# EAGLE design beagleboard (EAGLE 8.1.1)
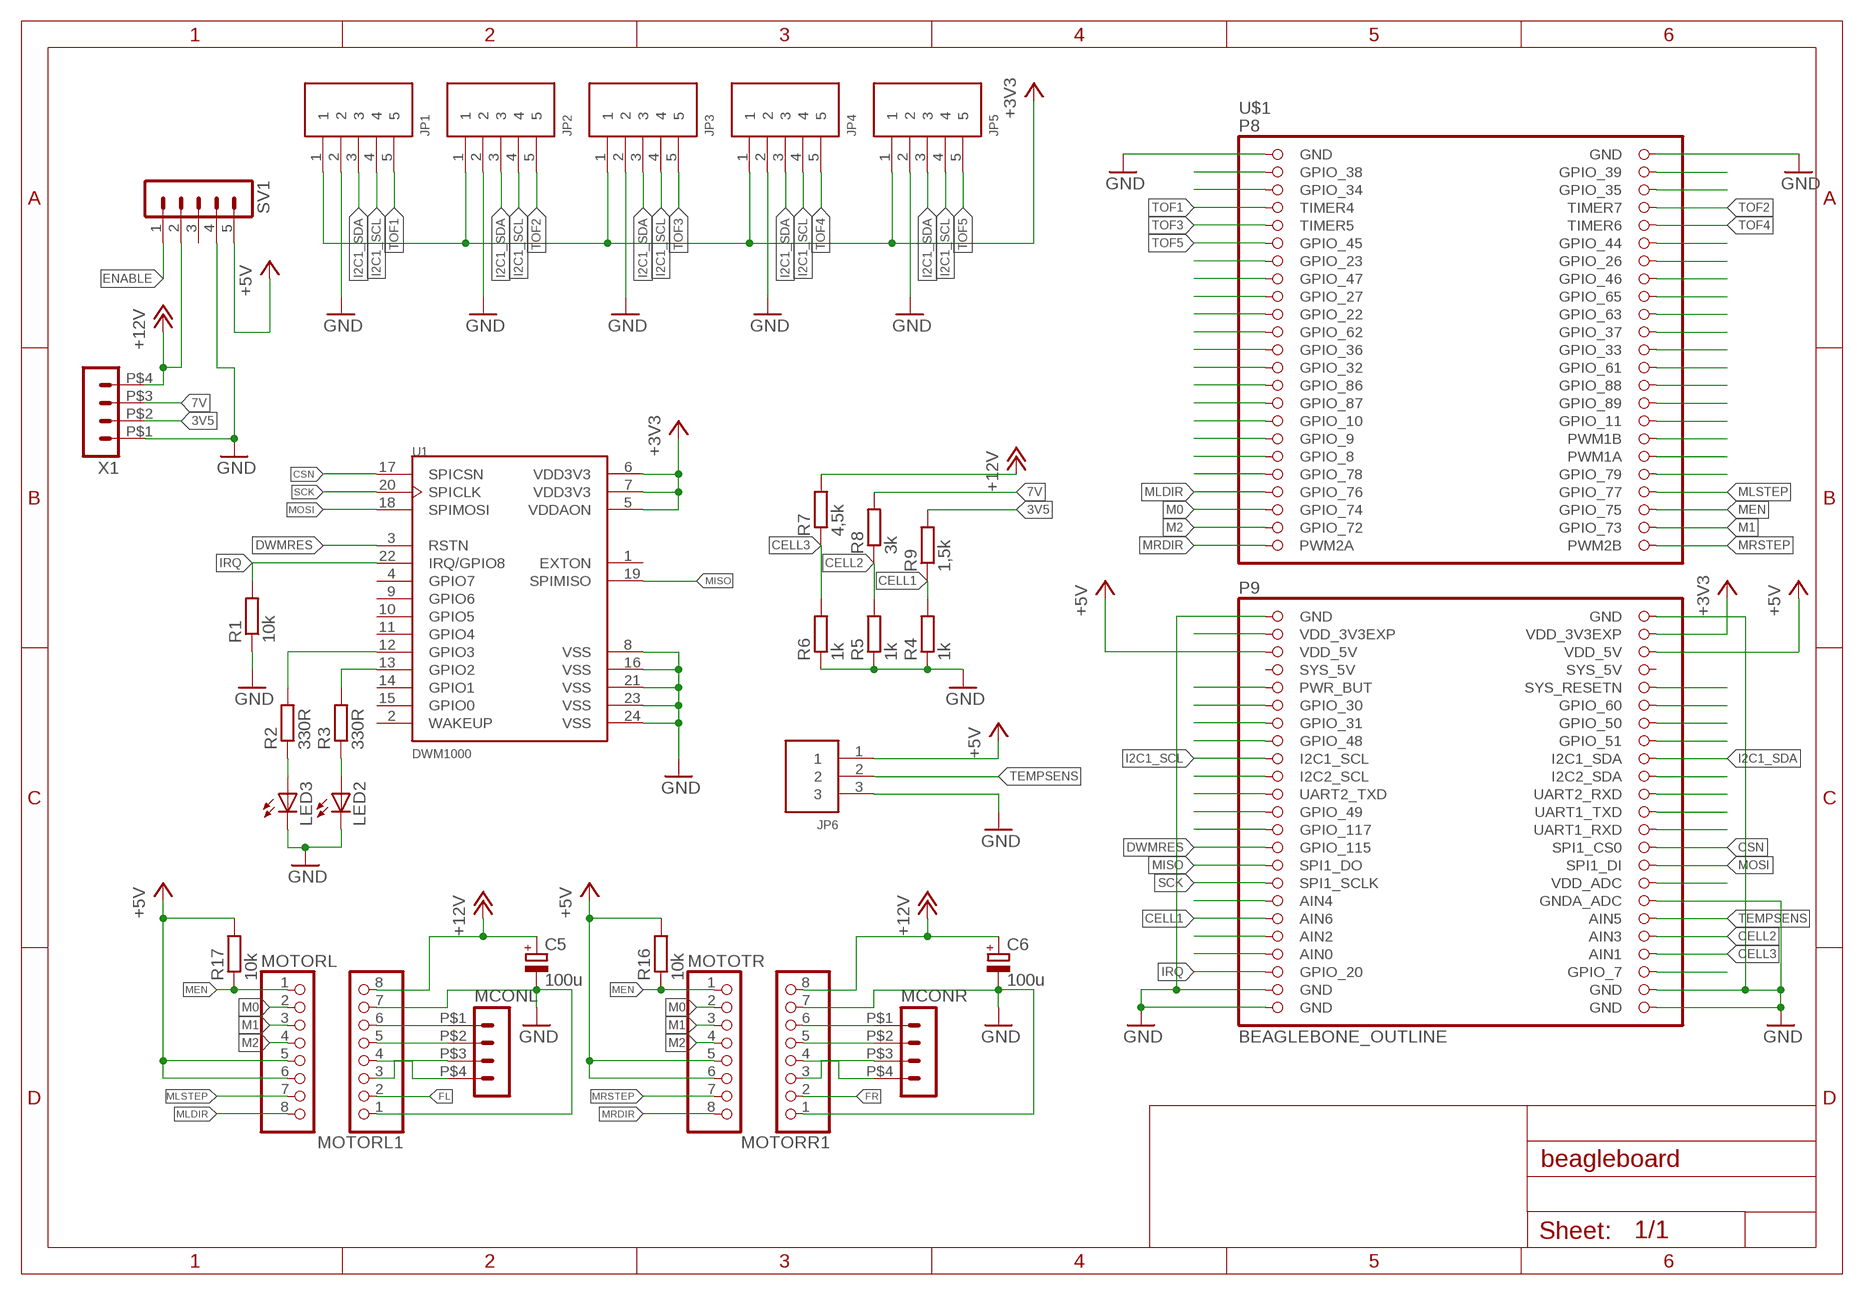
[diagram p0: schematic, sheet 1]

## Parts
C5  100u  CPOL-EU153CLV-0405  [153CLV-0405]
C6  100u  CPOL-EU153CLV-0405  [153CLV-0405]
JP1  5PIN  [B5B-PH-K-S]
JP2  5PIN  [B5B-PH-K-S]
JP3  5PIN  [B5B-PH-K-S]
JP4  5PIN  [B5B-PH-K-S]
JP5  5PIN  [B5B-PH-K-S]
JP6  3PIN  [B3B-PH-K-S]
LED2  LEDSML0603  [SML0603]
LED3  LEDSML0603  [SML0603]
MCONL  HEADER_POS4_43045-0412  [43045-0412]
MCONR  HEADER_POS4_43045-0412  [43045-0412]
MOTORL  PINHD-1X8  [1X08]
MOTORL1  PINHD-1X8  [1X08]
MOTORR1  PINHD-1X8  [1X08]
MOTOTR  PINHD-1X8  [1X08]
R1  10k  R-EU_R0603  [R0603]
R2  330R  R-EU_R0603  [R0603]
R3  330R  R-EU_R0603  [R0603]
R4  1k  R-EU_R0603  [R0603]
R5  1k  R-EU_R0603  [R0603]
R6  1k  R-EU_R0603  [R0603]
R7  4,5k  R-EU_R0603  [R0603]
R8  3k  R-EU_R0603  [R0603]
R9  1,5k  R-EU_R0603  [R0603]
R16  10k  R-EU_R0805  [R0805]
R17  10k  R-EU_R0805  [R0805]
SV1  MA05-1  [MA05-1]
U1  DWM1000  [XCVR_DWM1000]
U$1  BEAGLEBONE_OUTLINE  [BEAGLEBONE_SHIELD]
X1  HEADER_POS4_43045-0412  [43045-0412]

## Nets
3V5: R9.2 X1.P$2
7V: R8.2 X1.P$3
+3V3: JP1.1 JP2.1 JP3.1 JP4.1 JP5.1 U1.5(VDDAON) U1.6(VDD3V3) U1.7(VDD3V3) U$1.50(VDD_3V3EXP)
+5V: JP6.1 MOTORL.5 MOTORL.6 MOTOTR.5 MOTOTR.6 R16.2 R17.2 SV1.5 U$1.51(VDD_5V) U$1.52(VDD_5V)
+12V: C5.+ C6.+ MOTORL1.8 MOTORR1.8 R7.2 SV1.2 X1.P$4
CELL1: R4.2 R9.1 U$1.81(AIN6)
CELL2: R5.2 R8.1 U$1.84(AIN3)
CELL3: R6.2 R7.1 U$1.86(AIN1)
CSN: U1.17(SPICSN) U$1.74(SPI1_CS0)
D4ECHO: U$1.85(AIN0)
D4TRIG: U$1.83(AIN2)
DWMRES: U1.3(RSTN) U$1.73(GPIO_115)
ENABLE: SV1.1
FL: MOTORL1.2
FR: MOTORR1.2
GND: C5.- C6.- JP1.2 JP2.2 JP3.2 JP4.2 JP5.2 JP6.3 LED2.C LED3.C MOTORL1.1 MOTORL1.7 MOTORR1.1 MOTORR1.7 R1.1 R4.1 R5.1 R6.1 SV1.4 U1.8(VSS) U1.16(VSS) U1.21(VSS) U1.23(VSS) U1.24(VSS) U$1.1(GND) U$1.2(GND) U$1.47(GND) U$1.80(GNDA_ADC) U$1.89(GND) U$1.90(GND) U$1.91(GND) U$1.92(GND) X1.P$1
I2C1_SCL: JP1.4 JP2.4 JP3.4 JP4.4 JP5.4 U$1.63(I2C1_SCL)
I2C1_SDA: JP1.3 JP2.3 JP3.3 JP4.3 JP5.3 U$1.64(I2C1_SDA)
IRQ: R1.2 U1.22(IRQ/GPIO8) U$1.87(GPIO_20)
M0: MOTORL.2 MOTOTR.2 U$1.41(GPIO_74)
M1: MOTORL.3 MOTOTR.3 U$1.44(GPIO_73)
M2: MOTORL.4 MOTOTR.4 U$1.43(GPIO_72)
MEN: MOTORL.1 MOTOTR.1 R16.1 R17.1 U$1.42(GPIO_75)
MISO: U1.19(SPIMISO) U$1.75(SPI1_DO)
MLDIR: MOTORL.8 U$1.39(GPIO_76)
MLSTEP: MOTORL.7 U$1.40(GPIO_77)
MOSI: U1.18(SPIMOSI) U$1.76(SPI1_DI)
MRDIR: MOTOTR.8 U$1.45(PWM2A)
MRSTEP: MOTOTR.7 U$1.46(PWM2B)
N$1: MCONL.P$4 MOTORL1.4
N$2: R3.2 U1.13(GPIO2)
N$3: R2.2 U1.12(GPIO3)
N$5: LED2.A R3.1
N$6: LED3.A R2.1
N$9: MCONL.P$1 MOTORL1.6
N$10: MCONL.P$2 MOTORL1.5
N$11: MCONL.P$3 MOTORL1.3
N$12: MCONR.P$1 MOTORR1.6
N$13: MCONR.P$2 MOTORR1.5
N$14: MCONR.P$4 MOTORR1.4
N$15: MCONR.P$3 MOTORR1.3
N$16: U$1.48(GND)
N$17: U$1.3(GPIO_38)
N$18: U$1.4(GPIO_39)
N$19: U$1.5(GPIO_34)
N$20: U$1.12(GPIO_44)
N$21: U$1.6(GPIO_35)
N$22: U$1.16(GPIO_46)
N$23: U$1.37(GPIO_78)
N$25: U$1.14(GPIO_26)
N$26: U$1.15(GPIO_47)
N$27: U$1.18(GPIO_65)
N$28: U$1.20(GPIO_63)
N$29: U$1.22(GPIO_37)
N$30: U$1.24(GPIO_33)
N$31: U$1.26(GPIO_61)
N$32: U$1.28(GPIO_88)
N$33: U$1.30(GPIO_89)
N$34: U$1.32(GPIO_11)
N$35: U$1.34(PWM1B)
N$36: U$1.36(PWM1A)
N$37: U$1.38(GPIO_79)
N$39: U$1.55(PWR_BUT)
N$40: U$1.49(VDD_3V3EXP)
N$41: U$1.57(GPIO_30)
N$44: U$1.13(GPIO_23)
N$46: U$1.17(GPIO_27)
N$47: U$1.19(GPIO_22)
N$48: U$1.21(GPIO_62)
N$49: U$1.23(GPIO_36)
N$50: U$1.25(GPIO_32)
N$51: U$1.27(GPIO_86)
N$53: U$1.59(GPIO_31)
N$54: U$1.61(GPIO_48)
N$55: U$1.71(GPIO_117)
N$56: U$1.29(GPIO_87)
N$57: U$1.31(GPIO_10)
N$58: U$1.33(GPIO_9)
N$59: U$1.35(GPIO_8)
N$60: U$1.65(I2C2_SCL)
N$62: U$1.56(SYS_RESETN)
N$63: U$1.58(GPIO_60)
N$64: U$1.60(GPIO_50)
N$65: U$1.62(GPIO_51)
N$69: U$1.66(I2C2_SDA)
N$70: U$1.78(VDD_ADC)
N$71: U$1.68(UART2_RXD)
N$72: U$1.70(UART1_TXD)
N$73: U$1.72(UART1_RXD)
N$74: U$1.67(UART2_TXD)
N$75: U$1.69(GPIO_49)
N$77: U$1.88(GPIO_7)
N$104: U$1.79(AIN4)
SCK: U1.20(SPICLK) U$1.77(SPI1_SCLK)
TEMPSENS: JP6.2 U$1.82(AIN5)
TOF1: JP1.5 U$1.7(TIMER4)
TOF2: JP2.5 U$1.8(TIMER7)
TOF3: JP3.5 U$1.9(TIMER5)
TOF4: JP4.5 U$1.10(TIMER6)
TOF5: JP5.5 U$1.11(GPIO_45)
Unconnected: SV1.3 U1.1(EXTON) U1.2(WAKEUP) U1.4(GPIO7) U1.9(GPIO6) U1.10(GPIO5) U1.11(GPIO4) U1.14(GPIO1) U1.15(GPIO0) U$1.54(SYS_5V)

## Power pins joined to a net without a drawn wire
SYS_5V: U$1.53(SYS_5V)

## Library data of the parts
C5 C6 = rcl:CPOL-EU: POLARIZED CAPACITOR, European symbol
JP1-JP5 = jst_eph:5PIN
JP6 = jst_eph:3PIN
LED2 LED3 = led:LED: LED OSRAM: - CHIPLED LG R971, LG N971, LY N971, LG Q971, LY Q971, LO R971, LY R971 LH N974, LH R974 LS Q976, LO Q976, LY Q976 LO Q996 - Hyper CHIPLED LW Q18S LB Q993, LB Q99A, LB R99A - SideLED LS A670, LO A670, LY A670, LG A670, LP A670 LB A673, LV A673, LT A673, LW A673 LH A674 LY A675 LS A676, LA A676, LO A676, LY A676, LW A676 LS A679, LY A679, LG A679 - Hyper Micro SIDELED® LS Y876, LA Y876, LO Y876, LY Y876 LT Y87S - SmartLED LW L88C, LW L88S LB L89C, LB L89S, LG L890 LS L89K, LO L89K, LY L89K LS L896, LA L896, LO L896, LY L896 - TOPLED LS T670, LO T670, LY T670, LG T670, LP T670 LSG T670, LSP T670, LSY T670, LOP T670, LYG T670 LG T671, LOG T671, LSG T671 LB T673, LV T673, LT T673, LW T673 LH T674 LS T676, LA T676, LO T676, LY T676, LB T676, LH T676, LSB T676, LW T676 LB T67C, LV T67C, LT T67C, LS T67K, LO T67K, LY T67K, LW E67C LS E67B, LA E67B, LO E67B, LY E67B, LB E67C, LV E67C, LT E67C LW T67C LS T679, LY T679, LG T679 LS T770, LO T770, LY T770, LG T770, LP T770 LB T773, LV T773, LT T773, LW T773 LH T774 LS E675, LA E675, LY E675, LS T675 LS T776, LA T776, LO T776, LY T776, LB T776 LHGB T686 LT T68C, LB T68C - Hyper Mini TOPLED® LB M676 - Mini TOPLED Santana® LG M470 LS M47K, LO M47K, LY M47K Source: http://www.osram.convergy.de LUXEON: - LUMILED® LXK2-PW12-R00, LXK2-PW12-S00, LXK2-PW14-U00, LXK2-PW14-V00 LXK2-PM12-R00, LXK2-PM12-S00, LXK2-PM14-U00 LXK2-PE12-Q00, LXK2-PE12-R00, LXK2-PE12-S00, LXK2-PE14-T00, LXK2-PE14-U00 LXK2-PB12-K00, LXK2-PB12-L00, LXK2-PB12-M00, LXK2-PB14-N00, LXK2-PB14-P00, LXK2-PB14-Q00 LXK2-PR12-L00, LXK2-PR12-M00, LXK2-PR14-Q00, LXK2-PR14-R00 LXK2-PD12-Q00, LXK2-PD12-R00, LXK2-PD12-S00 LXK2-PH12-R00, LXK2-PH12-S00 LXK2-PL12-P00, LXK2-PL12-Q00, LXK2-PL12-R00 Source: www.luxeon.com KINGBRIGHT: KA-3528ASYC Source: www.kingbright.com
MCONL MCONR X1 = con-molex-micro-fit-3_0:HEADER_POS4_?: Molex - Micro-Fit 3.0 Series connector, 3.00mm (0.118") pitch header, 4 positions.
MOTORL MOTORL1 MOTORR1 MOTOTR = pinhead:PINHD-1X8: PIN HEADER
R1-R9 R16 R17 = rcl:R-EU_: RESISTOR, European symbol
SV1 = con-lstb:MA05-1: PIN HEADER; OC_FARNELL: unknown; OC_NEWARK: unknown
U1 = DWM1000:DWM1000: Mod Ieee802.15.4-2011 Uwb Txrx
U$1 = adafruit:BEAGLEBONE_OUTLINE: Should match A3 pinout - but not completely tested

## Net classes
0 default: clearance 0.205 mm

## Board
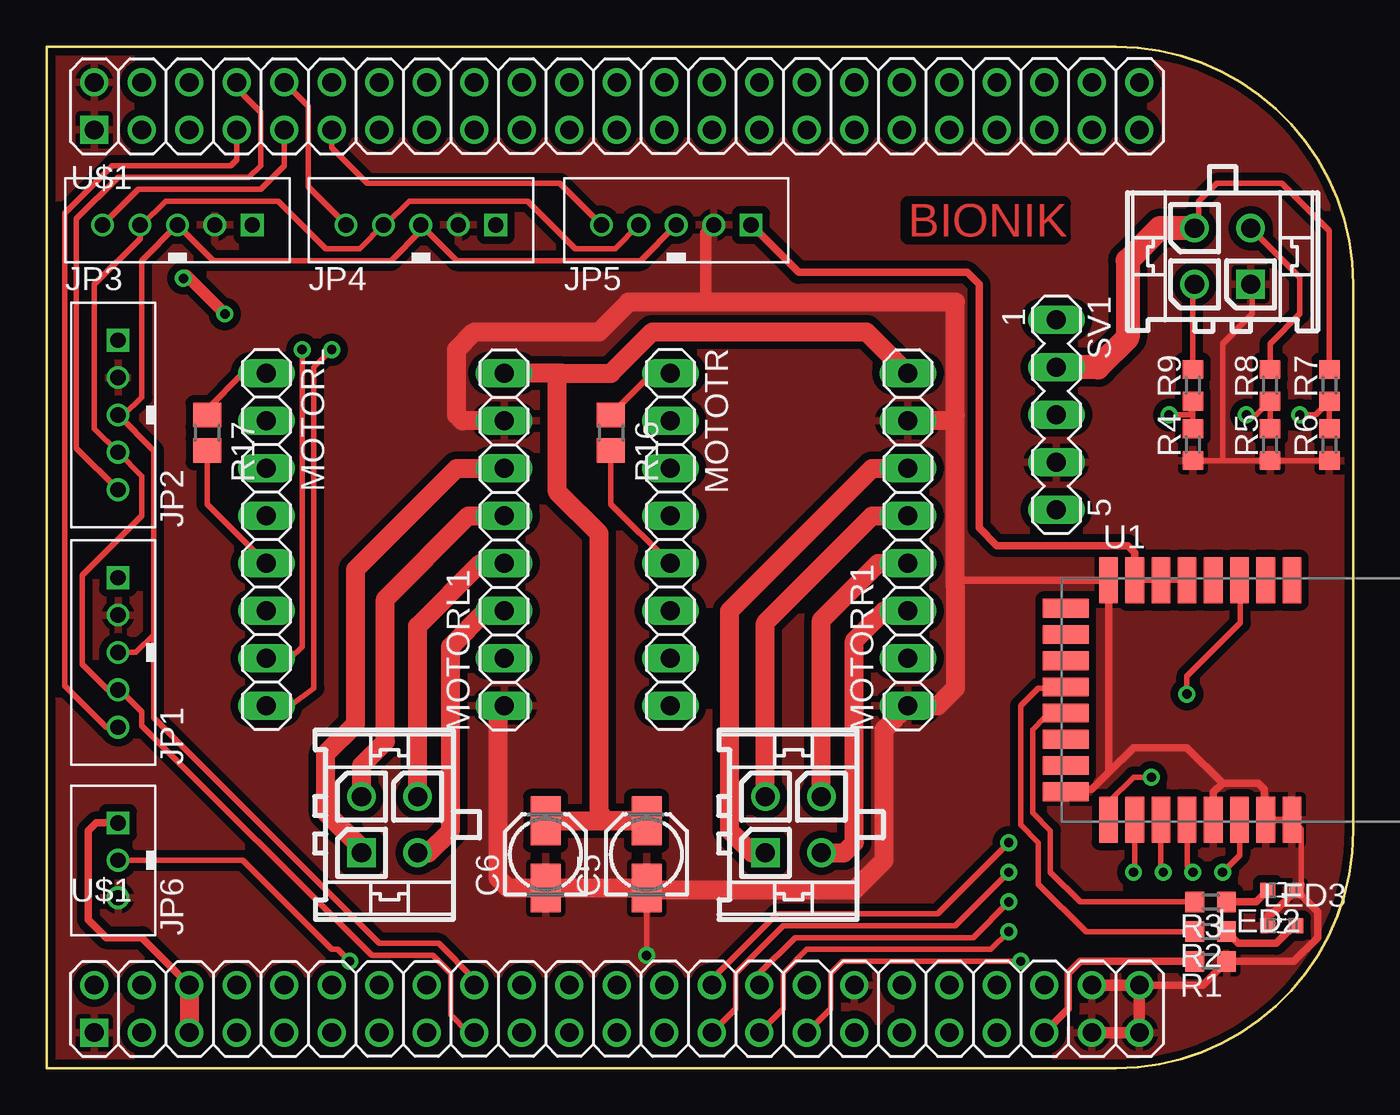
[diagram p1: board, top side]
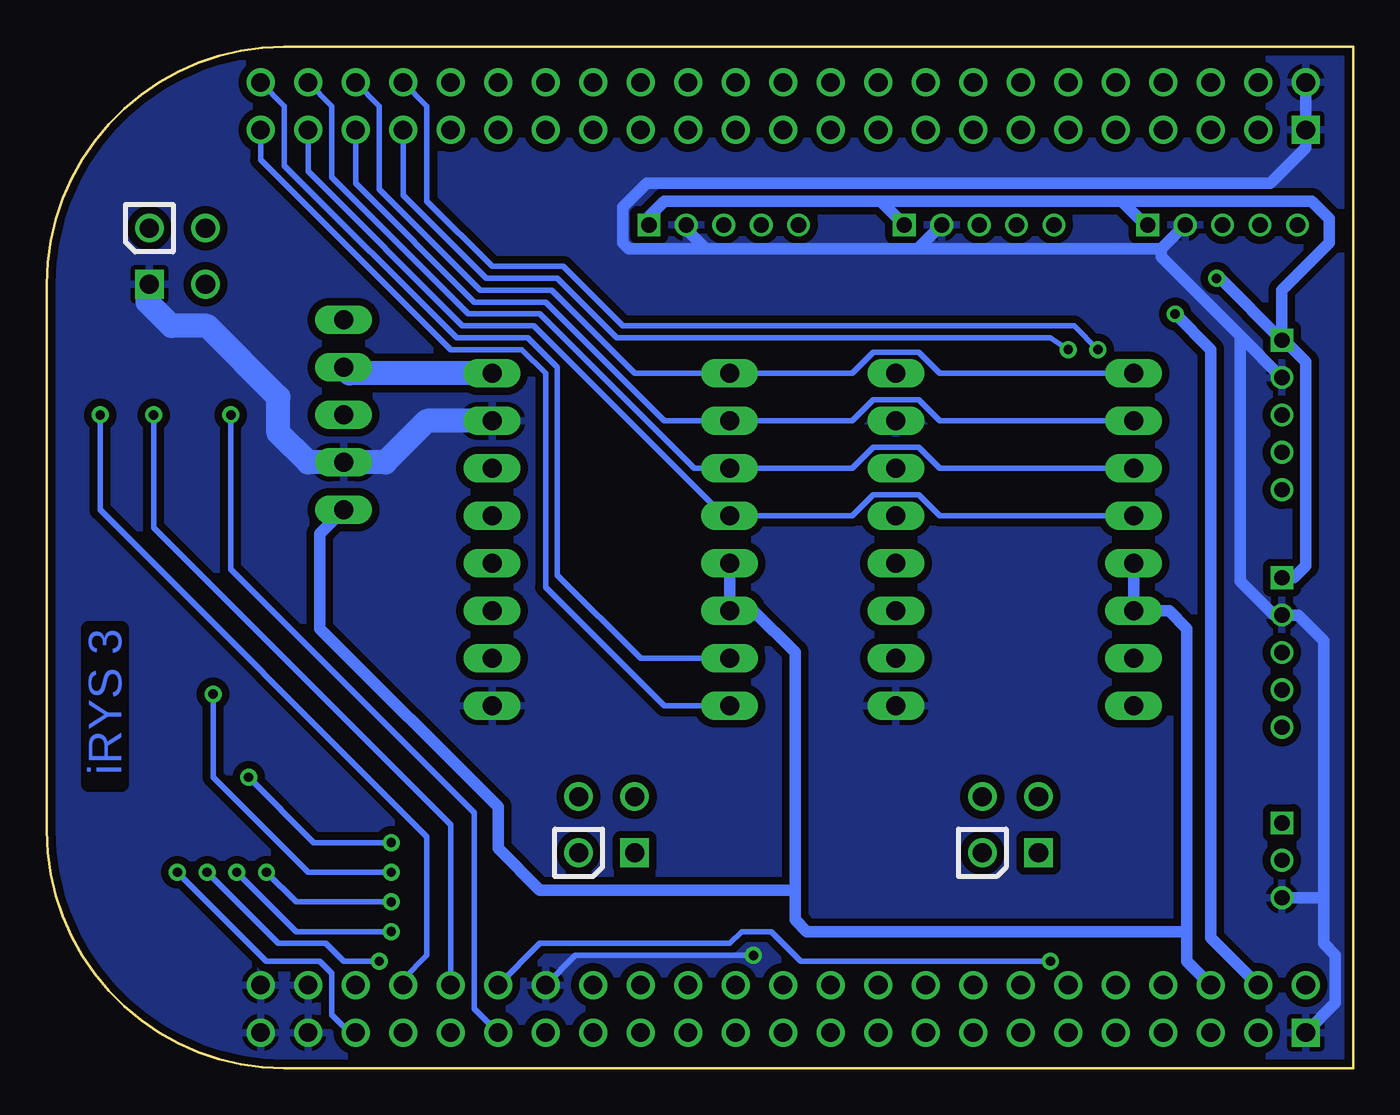
[diagram p2: board, bottom side, seen from below]

Size 69.85 x 54.61 mm. Coordinates in mm from the lower left corner, seen from the top.
Copper layers (1*16): Top 0.035mm / dielectric 1.5mm / Bottom 0.035mm
Design rules "default *": minimum track width 10mil, minimum drill 24mil, track to track 8mil, track to pad 8mil, pad to pad 8mil, via to via 8mil, smd to smd 8mil, copper to edge 8mil, drill to drill 8mil, minimum pad ring 8mil, minimum via ring 8mil, stop-mask expansion 4mil, vias tented up to drill 0mil, thermal gap 10mil

### Footprints (pad centres in the part's own frame; a part is rotated, then mirrored left to right if it is on the bottom)
153CLV-0405 = smd 2.6 x 1.6: + 1.8,0; - -1.8,0
B5B-PH-K-S = drill 0.813 square: 1 4,0 | drill 0.813: 2 2,0; 3 0,0; 4 -2,0; 5 -4,0
B3B-PH-K-S = drill 0.813 square: 1 2,0 | drill 0.813: 2 0,0; 3 -2,0
SML0603 = smd 0.8 x 0.8: A 0.75,0; C -0.75,0
43045-0412 = drill 1.02 square: P$1 1.5,0 | drill 1.02: P$2 -1.5,0; P$3 1.5,3; P$4 -1.5,3
1X08 = drill 1.016 long: 1 -8.89,0; 2 -6.35,0; 3 -3.81,0; 4 -1.27,0; 5 1.27,0; 6 3.81,0; 7 6.35,0; 8 8.89,0
R0603 = smd 1 x 1.1: 1 -0.85,0; 2 0.85,0
R0805 = smd 1.3 x 1.5: 1 -0.95,0; 2 0.95,0
MA05-1 = drill 1.016 long: 1 -5.08,0; 2 -2.54,0; 3 0,0; 4 2.54,0; 5 5.08,0
XCVR_DWM1000 = smd 2.45 x 1: 1 -6.4,1.8; 2 -6.4,0.4; 3 -6.4,-1; 4 -6.4,-2.4; 5 -6.4,-3.8; 6 -6.4,-5.2; 7 -6.4,-6.6; 8 -6.4,-8; 17 6.4,-8; 18 6.4,-6.6; 19 6.4,-5.2; 20 6.4,-3.8; 21 6.4,-2.4; 22 6.4,-1; 23 6.4,0.4; 24 6.4,1.8 | smd 1 x 2.45: 9 -4.9,-10.295; 10 -3.5,-10.295; 11 -2.1,-10.295; 12 -0.7,-10.295; 13 0.7,-10.295; 14 2.1,-10.295; 15 3.5,-10.295; 16 4.9,-10.295
BEAGLEBONE_SHIELD = drill 1 square: 1 4.445,2.54; 47 52.705,2.54 | drill 1: 2 1.905,2.54; 3 4.445,5.08; 4 1.905,5.08; 5 4.445,7.62; 6 1.905,7.62; 7 4.445,10.16; 8 1.905,10.16; 9 4.445,12.7; 10 1.905,12.7; 11 4.445,15.24; 12 1.905,15.24; 13 4.445,17.78; 14 1.905,17.78; 15 4.445,20.32; 16 1.905,20.32; 17 4.445,22.86; 18 1.905,22.86; 19 4.445,25.4; 20 1.905,25.4; 21 4.445,27.94; 22 1.905,27.94; 23 4.445,30.48; 24 1.905,30.48; 25 4.445,33.02; 26 1.905,33.02; 27 4.445,35.56; 28 1.905,35.56; 29 4.445,38.1; 30 1.905,38.1; 31 4.445,40.64; 32 1.905,40.64; 33 4.445,43.18; 34 1.905,43.18; 35 4.445,45.72; 36 1.905,45.72; 37 4.445,48.26; 38 1.905,48.26; 39 4.445,50.8; 40 1.905,50.8; 41 4.445,53.34; 42 1.905,53.34; 43 4.445,55.88; 44 1.905,55.88; 45 4.445,58.42; 46 1.905,58.42; 48 50.165,2.54; 49 52.705,5.08; 50 50.165,5.08; 51 52.705,7.62; 52 50.165,7.62; 53 52.705,10.16; 54 50.165,10.16; 55 52.705,12.7; 56 50.165,12.7; 57 52.705,15.24; 58 50.165,15.24; 59 52.705,17.78; 60 50.165,17.78; 61 52.705,20.32; 62 50.165,20.32; 63 52.705,22.86; 64 50.165,22.86; 65 52.705,25.4; 66 50.165,25.4; 67 52.705,27.94; 68 50.165,27.94; 69 52.705,30.48; 70 50.165,30.48; 71 52.705,33.02; 72 50.165,33.02; 73 52.705,35.56; 74 50.165,35.56; 75 52.705,38.1; 76 50.165,38.1; 77 52.705,40.64; 78 50.165,40.64; 79 52.705,43.18; 80 50.165,43.18; 81 52.705,45.72; 82 50.165,45.72; 83 52.705,48.26; 84 50.165,48.26; 85 52.705,50.8; 86 50.165,50.8; 87 52.705,53.34; 88 50.165,53.34; 89 52.705,55.88; 90 50.165,55.88; 91 52.705,58.42; 92 50.165,58.42

### Placement (x,y rotation side)
C5  32.07,11.43 90 top
C6  26.67,11.43 90 top
JP1  3.81,22.23 90 top
JP2  3.81,34.93 90 top
JP3  6.99,45.09 0 top
JP4  20,45.09 0 top
JP5  33.66,45.09 0 top
JP6  3.81,11.11 90 top
LED2  66.04,9.53 180 top
LED3  66.04,7.62 0 top
MCONL  16.83,13.02 270 top
MCONR  38.42,13.02 270 top
MOTORL  11.75,28.26 270 top
MOTORL1  24.45,28.26 90 top
MOTORR1  46.04,28.26 90 top
MOTOTR  33.34,28.26 270 top
R1  62.23,5.72 180 top
R2  62.23,7.3 180 top
R3  62.23,8.89 180 top
R4  61.28,33.34 90 top
R5  65.4,33.34 90 top
R6  68.58,33.34 90 top
R7  68.58,36.51 90 top
R8  65.4,36.51 90 top
R9  61.28,36.51 90 top
R16  30.16,33.97 270 top
R17  8.57,33.97 270 top
SV1  53.98,34.93 270 top
U1  64.77,19.69 270 top
U$1  0,54.61 270 top
X1  62.87,41.91 0 top

### Tracks (layer width: path | path; a pad name or v marks a point on that pad's centre or on a via)
3V5
  Top 0.305: R9.2 61.28,41.82 X1.P$2
7V
  Top 0.305: R8.2 65.4,38.73 66.99,40.32 66.99,42.28 X1.P$3
+3V3  (via drill 0.5)
  Top 0.305: U1.5 U1.6 U1.7
  Top 0.406: U1.7 58.17,27.56 57.79,27.94 50.8,27.94 49.85,28.89 49.85,41.91 49.21,42.55 40.2,42.55 JP5.1
  Top 0.61: v9.52,40.32 7.45,42.39 7.45,42.38 v7.3,42.23
  Bottom 0.61: JP5.1 37.66,45.53 36.83,46.36 25.27,46.36 | 25.27,46.36 JP4.1 | JP3.1 11.11,45.09 12.38,46.36 | 12.38,46.36 25.27,46.36 | JP2.1 3.81,41.59 1.27,44.13 1.27,45.4 2.22,46.36 12.38,46.36 | JP2.1 3.68,38.93 2.54,37.78 2.54,26.86 3.17,26.23 JP1.1 | v9.52,40.32 7.62,38.42 7.62,6.99 U$1.50 | v7.3,42.23 7.11,42.23 JP2.1
+5V
  Top 0.305: MOTORL.5 8.57,30.16 R17.2 | R16.2 30.16,30.16 MOTOTR.5
  Top 0.406: JP6.1 2.63,13.11 2.22,12.7 2.22,7.94 3.17,6.99 5.08,6.99 U$1.52
  Top 1.016: U$1.52 U$1.51
  Bottom 0.61: MOTORL.5 MOTORL.6 9.84,24.45 8.89,23.5 8.89,7.3 | 8.89,7.3 8.89,5.72 U$1.52 | MOTOTR.5 MOTOTR.6 32.07,24.45 29.84,22.23 29.84,9.53 | 8.89,7.3 29.21,7.3 29.84,7.94 29.84,9.53 | SV1.5 55.24,28.58 55.24,23.5 45.72,13.97 45.72,11.75 43.5,9.53 29.84,9.53
+12V
  Top 0.305: R7.2 68.58,44.77 66.04,47.31 62.55,47.31 61.6,46.36 61.6,45.14 X1.P$4
  Top 1.016: MOTORR1.8 43.81,39.37 32.38,39.37 30.16,37.15 27.62,37.15 | C6.+ C5.+ 29.95,13.23 29.53,13.65 29.53,28.58 27.3,30.8 27.3,36.83 27.62,37.15 | 27.62,37.15 MOTORL1.8
  Top 1.27: X1.P$4 59.52,44.91 57.79,43.18 57.79,39.05 56.2,37.47 SV1.2
  Bottom 1.27: MOTORR1.8 53.66,37.15 SV1.2
CELL1  (via drill 0.5)
  Top 0.305: v60.01,34.93 61.18,34.93 R9.1 R4.2
  Bottom 0.305: U$1.81 46.99,3.18 46.99,13.65 60.01,26.67 v60.01,34.93
CELL2  (via drill 0.5)
  Top 0.305: v64.13,34.93 64.67,34.93 R8.1 R5.2
  Bottom 0.305: U$1.84 48.26,13.02 64.13,28.89 v64.13,34.93
CELL3  (via drill 0.5)
  Top 0.305: v66.99,34.93 67.84,34.93 R7.1 R6.2
  Bottom 0.305: U$1.86 50.8,4.76 49.53,6.03 49.53,12.38 66.99,29.85 v66.99,34.93
CSN  (via drill 0.5)
  Top 0.305: U$1.74 35.56,4.76 39.05,8.26 47.62,8.26 v51.44,12.07 | v59.05,15.56 58.1,15.56 56.83,14.29 56.83,12.71 U1.17
  Bottom 0.305: v51.44,12.07 55.56,12.07 v59.05,15.56
DWMRES  (via drill 0.5)
  Top 0.305: U$1.73 36.83,3.18 36.83,5.08 39.37,7.62 48.58,7.62 v51.44,10.48 | v60.96,20 60.96,20.96 63.82,23.81 63.82,26.04 U1.3
  Bottom 0.305: v51.44,10.48 55.88,10.48 60.96,15.56 v60.96,20
GND  (via drill 0.5)
  Top 0.305: v32.07,6.03 C5.- | 67.07,9.81 67.07,12.78 U1.24 U1.23 | R6.1 R5.1 62.87,32.49 | 62.87,32.49 R4.1 | 62.87,32.49 62.87,38.73 64.45,40.32 64.45,41.82 X1.P$1
  Top 0.406: LED2.C 67.07,9.81 | LED3.C 65.29,8.14 65.4,8.26 65.52,8.26 LED2.C | R1.1 66.67,5.72 67.94,6.99 67.94,8.37 LED2.C | U$1.92 61.81,4.45 R1.1 | R1.1 62.87,5.72 | 48.58,25.72 48.95,26.09 U1.8 56.77,15.81 | 56.77,15.81 55.88,14.92 54.61,14.92 U1.16 | U1.21 62.37,14.75 62.87,15.24 | 62.87,15.24 64.77,15.24 65.09,14.92 65.09,13.37 U1.23 | 56.77,15.81 58.1,17.15 60.96,17.15 62.87,15.24
  Top 0.61: U$1.89 U$1.91 U$1.92 U$1.90 | 35.24,40.96 35.24,44.67 JP5.2
  Top 1.016: MOTORL1.1 24.13,19.05 24.13,10.16 24.66,9.63 C6.- C5.- 32.17,9.53 43.18,9.53 44.77,11.11 44.77,18.1 MOTORR1.1 47.62,19.37 48.58,20.32 48.58,25.72 48.58,34.93 | MOTORL1.7 22.23,34.61 21.91,34.93 21.91,38.42 22.86,39.37 29.53,39.37 31.12,40.96 35.24,40.96 48.58,40.96 48.58,34.93 | MOTORR1.7 48.26,34.61 48.58,34.93
  Bottom 0.305: U$1.80 41.59,6.03 v32.07,6.03
  Bottom 0.61: JP5.2 35.66,44.86 34.61,43.82 | 34.61,43.82 23.27,43.82 | 23.27,43.82 JP4.2 | 23.27,43.82 10.25,43.82 | 10.25,43.82 JP3.2 | 10.25,43.82 10.25,43.37 6.03,39.15 | 6.03,39.15 JP2.2 | U$1.2 U$1.1 2.54,49.21 4.45,47.31 37.78,47.31 39.05,46.04 39.05,44.13 38.73,43.82 34.61,43.82 | 6.03,39.15 6.03,26.04 4.22,24.23 JP1.2 2.95,24.23 1.59,22.86 1.59,8.89 | 1.59,8.89 1.59,6.67 0.95,6.03 0.95,3.49 U$1.47 | JP6.3 1.81,9.11 1.59,8.89
  Bottom 1.27: X1.P$1 64.45,41.82 64.45,40.96 63.18,39.69 61.28,39.69 57.47,35.88 57.47,33.97 55.88,32.39 SV1.4 51.75,32.39 49.53,34.61 MOTORR1.7
  pour Top (isolate 0.406): 0,54.61 0,0 57.79,0 arc90 69.85,12.07 69.85,42.55 arc90 57.79,54.61 57.15,54.61
  pour Bottom (isolate 0.406): 0,0 57.79,0 arc90 69.85,12.07 69.85,41.91 69.85,42.55 arc90 57.79,54.61 0,54.61
I2C1_SCL
  Top 0.305: U$1.63 22.54,1.91 21.59,2.86 21.59,5.08 20.64,6.03 17.37,6.03 5.08,18.32 5.08,19.05 3.91,20.23 JP1.4 3.27,20.23 1.91,21.59 1.91,26.35 5.08,29.53 5.08,31.66 JP2.4 2.54,34.2 2.54,41.91 4.99,44.36 JP3.4 5.08,45.09 6.35,46.36 12.38,46.36 14.92,43.82 16.73,43.82 JP4.4 18.1,45.09 19.37,46.36 25.72,46.36 28.26,43.82 30.38,43.82 JP5.4
I2C1_SDA
  Top 0.305: U$1.64 22.86,4.76 20.96,6.67 17.78,6.67 5.72,18.73 5.72,23.18 | 5.72,23.18 5.72,33.02 JP2.3 4.13,34.93 5.08,35.88 5.08,43.18 JP3.3 8.89,43.18 18.41,43.18 20,44.77 JP4.3 21.91,43.18 31.75,43.18 JP5.3 | 5.72,23.18 4.76,22.23 JP1.3
IRQ  (via drill 0.5)
  Top 0.305: U1.22 63.77,11.38 v62.87,10.48
  Top 0.406: U$1.87 54.61,3.18 54.61,5.08 55.24,5.72 R1.2
  Bottom 0.305: U$1.87 53.66,1.91 54.61,2.86 54.61,5.08 55.24,5.72 58.1,5.72 v62.87,10.48
M0
  Bottom 0.305: MOTORL.2 22.1,34.61 23.22,35.73 25.67,35.73 26.79,34.61 MOTOTR.2 36.83,34.61 43.18,40.96 46.99,40.96 53.34,47.31 U$1.41
M1
  Bottom 0.305: MOTORL.3 22.1,32.07 23.22,33.19 25.67,33.19 26.79,32.07 MOTOTR.3 35.24,32.07 43.5,40.32 47.31,40.32 54.61,47.62 54.61,51.44 U$1.44
M2
  Bottom 0.305: U$1.43 55.88,47.94 47.62,39.69 43.81,39.69 33.97,29.85 33.66,29.85 MOTOTR.4 26.79,29.53 25.67,30.65 23.22,30.65 22.1,29.53 MOTORL.4
MEN
  Top 0.305: MOTORL.1 10.48,37.15 8.57,35.24 R17.1 | R16.1 32.38,37.15 MOTOTR.1
  Bottom 0.305: MOTORL.1 22.1,37.15 23.22,38.27 25.67,38.27 26.79,37.15 MOTOTR.1 38.42,37.15 42.86,41.59 46.67,41.59 52.07,46.99 52.07,51.44 U$1.42
MISO  (via drill 0.5)
  Top 0.305: U$1.75 39.37,3.18 39.37,5.08 40.64,6.35 50.48,6.35 v51.44,7.3 | U1.19 59.57,10.6 v59.69,10.48
  Bottom 0.305: v51.44,7.3 56.52,7.3 v59.69,10.48
MLDIR  (via drill 0.5)
  Top 0.305: MOTORL.8 13.02,19.37 14.29,20.32 14.29,37.47 v15.24,38.42
  Bottom 0.305: U$1.39 50.8,46.67 46.36,42.23 42.55,42.23 39.37,39.05 16.19,39.05 v15.24,38.42
MLSTEP  (via drill 0.5)
  Top 0.305: v13.65,38.42 13.65,22.54 13.02,21.91 MOTORL.7
  Bottom 0.305: U$1.40 49.53,51.44 49.53,46.36 46.04,42.86 42.23,42.86 39.05,39.69 14.92,39.69 v13.65,38.42
MOSI  (via drill 0.5)
  Top 0.305: U$1.76 38.1,5.08 40.01,6.99 49.53,6.99 v51.44,8.89 | U1.18 58.17,10.55 v58.1,10.48
  Bottom 0.305: v51.44,8.89 56.52,8.89 v58.1,10.48
MRDIR
  Bottom 0.305: U$1.45 58.42,48.58 48.26,38.42 44.45,38.42 43.18,37.15 43.18,25.72 36.83,19.37 MOTOTR.8
MRSTEP
  Bottom 0.305: U$1.46 57.15,51.44 57.15,48.26 47.94,39.05 44.13,39.05 42.55,37.47 42.55,26.35 38.1,21.91 MOTOTR.7
N$1
  Top 1.016: MCONL.P$4 19.83,23.64 23.18,26.99 MOTORL1.4
N$2
  Top 0.305: R3.2 55.24,8.89 53.66,10.48 53.66,12.7 52.7,13.65 52.7,18.1 53.34,18.73 54.22,18.73 U1.13
N$3
  Top 0.305: U1.12 53.65,20.39 53.58,20.32 53.02,20.32 52.07,19.37 52.07,13.02 53.02,12.07 53.02,9.84 55.56,7.3 R2.2
N$5
  Top 0.406: R3.1 64.65,8.89 LED2.A
N$6
  Top 0.406: LED3.A 66.15,7.1 65.72,6.67 63.71,6.67 R2.1
N$9
  Top 1.016: MCONL.P$1 16.83,11.75 14.92,13.65 14.92,16.83 16.51,18.42 16.51,26.67 21.91,32.07 MOTORL1.6
N$10
  Top 1.016: MCONL.P$2 16.83,16.19 18.1,17.46 18.1,25.08 22.54,29.53 MOTORL1.5
N$11
  Top 1.016: MCONL.P$3 20.41,11.52 21.59,12.7 21.59,22.54 23.5,24.45 MOTORL1.3
N$12
  Top 1.016: MCONR.P$1 37.7,11.52 36.51,12.7 36.51,24.45 44.13,32.07 MOTORR1.6
N$13
  Top 1.016: MCONR.P$2 38.42,23.81 44.13,29.53 MOTORR1.5
N$14
  Top 1.016: MCONR.P$4 41.42,23.96 44.45,26.99 MOTORR1.4
N$15
  Top 1.016: MCONR.P$3 42.63,11.52 43.18,12.07 43.18,22.86 44.77,24.45 MOTORR1.3
SCK  (via drill 0.5)
  Top 0.305: U$1.77 41.91,3.18 41.91,5.08 42.55,5.72 v52.07,5.72 | U1.20 60.97,10.79 v61.28,10.48
  Bottom 0.305: v52.07,5.72 53.98,5.72 54.93,6.67 57.47,6.67 v61.28,10.48
TEMPSENS  (via drill 0.5)
  Top 0.305: JP6.2 10.48,11.11 15.24,6.35 15.56,6.35 v16.19,5.72
  Bottom 0.305: v16.19,5.72 29.53,5.72 31.12,7.3 32.7,7.3 33.34,6.67 43.5,6.67 U$1.82
TOF1
  Top 0.305: U$1.7 10.16,48.58 9.84,48.26 3.49,48.26 0.95,45.72 0.95,20.45 3.17,18.23 JP1.5
TOF2
  Top 0.305: U$1.8 10.16,52.39 11.43,51.12 11.43,48.26 10.8,47.62 3.81,47.62 1.59,45.4 1.59,33.15 JP2.5
TOF3
  Top 0.305: JP3.5 4.89,46.99 11.43,46.99 12.7,48.26 U$1.9
TOF4
  Top 0.305: U$1.10 13.97,51.44 13.97,47.12 JP4.5
TOF5
  Top 0.305: U$1.11 15.24,49.21 17.14,47.31 27.43,47.31 JP5.5

### Text on the board
Top: BIONIK
Bottom: iRYS 3